# Altium schematic sheet 03 - ETHERNET.SchDoc
size A4
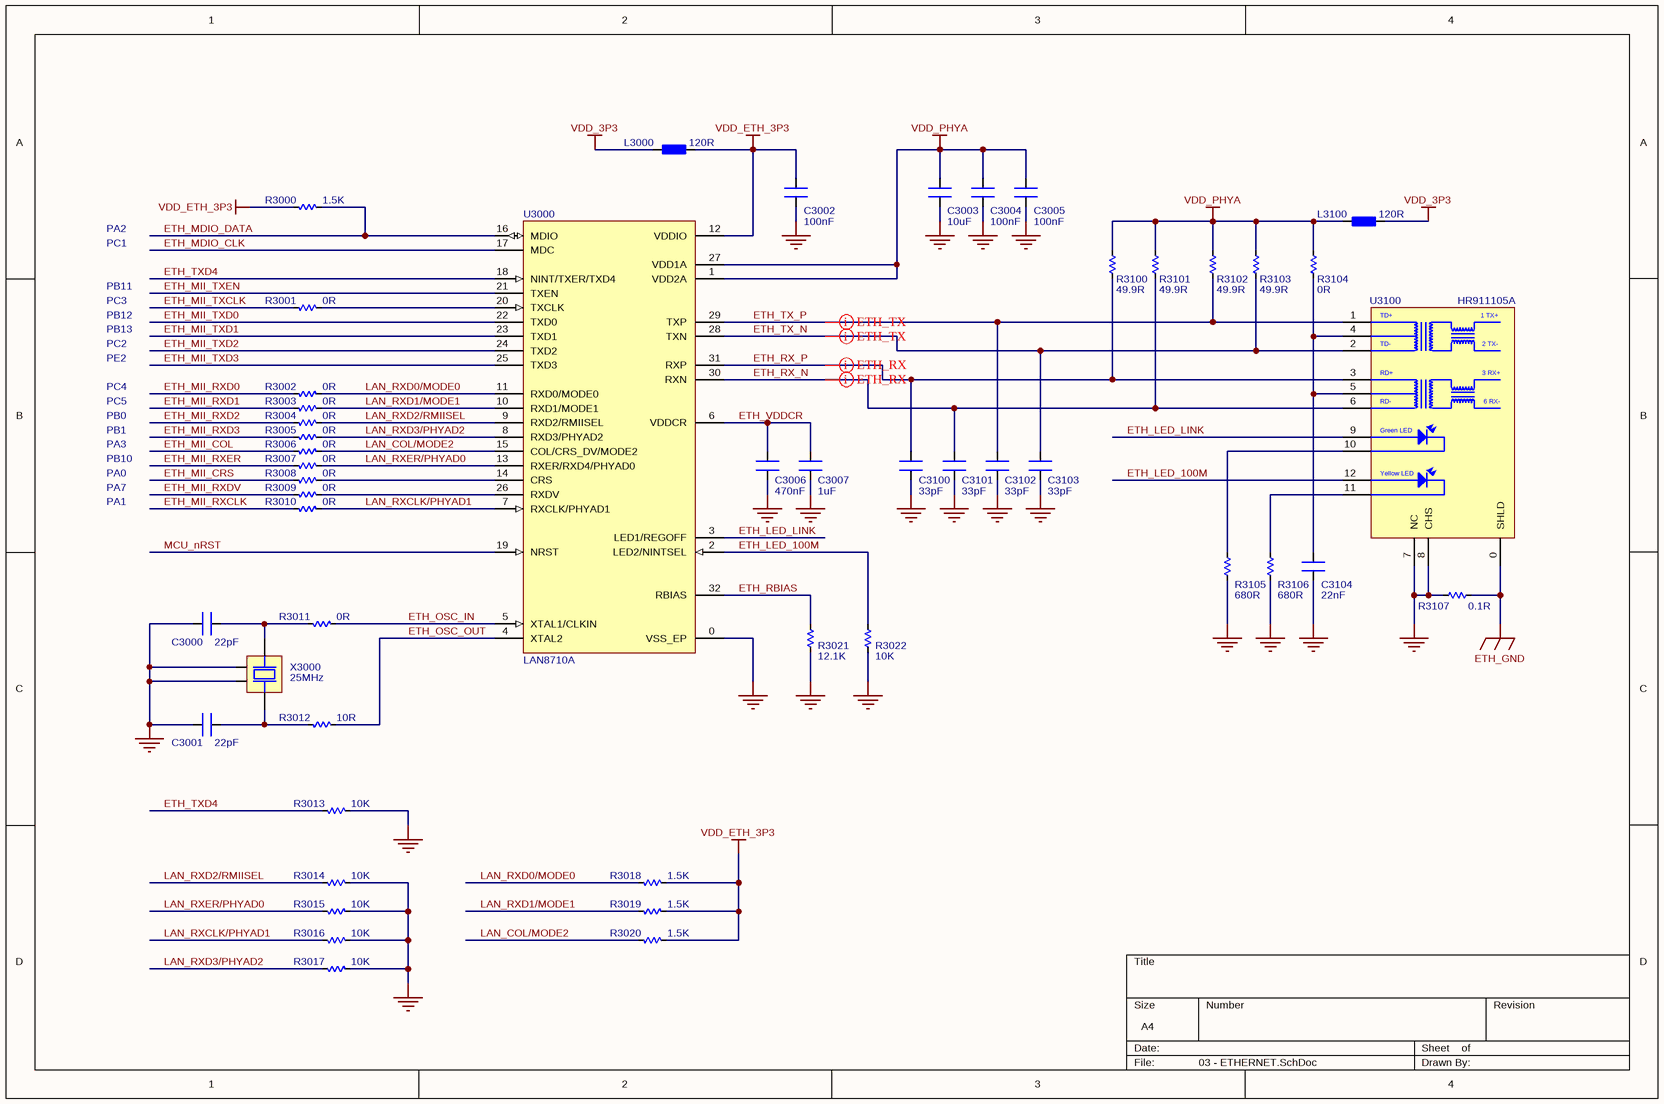
[diagram p0: 03 - ETHERNET.SchDoc]

## Parts
C3000  value 22pF  [CN-SMD-0402]  (hidden comment: Capacitor)
C3001  value 22pF  [CN-SMD-0402]  (hidden comment: Capacitor)
C3002  value 100nF  [CN-SMD-0402]  (hidden comment: Capacitor)
C3003  value 10uF  [CN-SMD-0603]  (hidden comment: Capacitor)
C3004  value 100nF  [CN-SMD-0402]  (hidden comment: Capacitor)
C3005  value 100nF  [CN-SMD-0402]  (hidden comment: Capacitor)
C3006  value 470nF  [CN-SMD-0402]  (hidden comment: Capacitor)
C3007  value 1uF  [CN-SMD-0603]  (hidden comment: Capacitor)
C3100  value 33pF  [CN-SMD-0402]  (hidden comment: Capacitor)
C3101  value 33pF  [CN-SMD-0402]  (hidden comment: Capacitor)
C3102  value 33pF  [CN-SMD-0402]  (hidden comment: Capacitor)
C3103  value 33pF  [CN-SMD-0402]  (hidden comment: Capacitor)
C3104  value 22nF  [CN-SMD-0402]  (hidden comment: Capacitor)
L3000  value 120R  [L-SMD-0603]  (hidden comment: Ferrite bead)
L3100  value 120R  [L-SMD-0603]  (hidden comment: Ferrite bead)
R3000  value 1.5K  [RES-SMD-0402]  (hidden comment: Resistor)
R3001  value 0R  [RES-SMD-0402]  (hidden comment: Resistor)
R3002  value 0R  [RES-SMD-0402]  (hidden comment: Resistor)
R3003  value 0R  [RES-SMD-0402]  (hidden comment: Resistor)
R3004  value 0R  [RES-SMD-0402]  (hidden comment: Resistor)
R3005  value 0R  [RES-SMD-0402]  (hidden comment: Resistor)
R3006  value 0R  [RES-SMD-0402]  (hidden comment: Resistor)
R3007  value 0R  [RES-SMD-0402]  (hidden comment: Resistor)
R3008  value 0R  [RES-SMD-0402]  (hidden comment: Resistor)
R3009  value 0R  [RES-SMD-0402]  (hidden comment: Resistor)
R3010  value 0R  [RES-SMD-0402]  (hidden comment: Resistor)
R3011  value 0R  [RES-SMD-0402]  (hidden comment: Resistor)
R3012  value 10R  [RES-SMD-0402]  (hidden comment: Resistor)
R3013  value 10K  [RES-SMD-0402]  (hidden comment: Resistor)
R3014  value 10K  [RES-SMD-0402]  (hidden comment: Resistor)
R3015  value 10K  [RES-SMD-0402]  (hidden comment: Resistor)
R3016  value 10K  [RES-SMD-0402]  (hidden comment: Resistor)
R3017  value 10K  [RES-SMD-0402]  (hidden comment: Resistor)
R3018  value 1.5K  [RES-SMD-0402]  (hidden comment: Resistor)
R3019  value 1.5K  [RES-SMD-0402]  (hidden comment: Resistor)
R3020  value 1.5K  [RES-SMD-0402]  (hidden comment: Resistor)
R3021  value 12.1K  [RES-SMD-0402]  (hidden comment: Resistor)
R3022  value 10K  [RES-SMD-0402]  (hidden comment: Resistor)
R3100  value 49.9R  [RES-SMD-0402]  (hidden comment: Resistor)
R3101  value 49.9R  [RES-SMD-0402]  (hidden comment: Resistor)
R3102  value 49.9R  [RES-SMD-0402]  (hidden comment: Resistor)
R3103  value 49.9R  [RES-SMD-0402]  (hidden comment: Resistor)
R3104  value 0R  [RES-SMD-0402]  (hidden comment: Resistor)
R3105  value 680R  [RES-SMD-0402]  (hidden comment: Resistor)
R3106  value 680R  [RES-SMD-0402]  (hidden comment: Resistor)
R3107  value 0.1R  [RES-SMD-1206]  (hidden comment: Resistor)
U3000  LAN8710A  [QFN50P500X500X100-33N-D]
U3100  HR911105A  [RJ-45_HR911105A]
X3000  value 25MHz  [XT-SMD-3225-4P]  (hidden comment: Crystal)

## Nets
ETH_GND: R3107.2 U3100.0(SHLD)
GND: C3000.2 C3001.2 C3002.1 C3003.1 C3004.1 C3005.1 C3006.1 C3007.1 C3100.1 C3101.1 C3102.1 C3103.1 C3104.1 R3013.1 R3014.1 R3015.1 R3016.1 R3017.1 R3021.1 R3022.2 R3105.2 R3106.2 R3107.1 U3000.0(VSS_EP) U3100.7(NC) U3100.8(CHS) X3000.2 X3000.4
VDD_3P3: L3000.2 L3100.1
VDD_ETH_3P3: C3002.2 L3000.1 R3000.2 R3018.1 R3019.1 R3020.1 U3000.12(VDDIO)
VDD_PHYA: C3003.2 C3004.2 C3005.2 L3100.2 R3100.1 R3101.1 R3102.1 R3103.1 R3104.1 U3000.1(VDD2A) U3000.27(VDD1A)
ETH_LED_100M: R3022.1 U3000.2(LED2/NINTSEL) U3100.12(Yellow+)
ETH_LED_LINK: U3000.3(LED1/REGOFF) U3100.9(Green+)
ETH_MDIO_CLK: U3000.17(MDC)
ETH_MDIO_DATA: R3000.1 U3000.16(MDIO)
ETH_MII_COL: R3006.2
ETH_MII_CRS: R3008.2
ETH_MII_RXCLK: R3010.2
ETH_MII_RXD0: R3002.2
ETH_MII_RXD1: R3003.2
ETH_MII_RXD2: R3004.2
ETH_MII_RXD3: R3005.2
ETH_MII_RXDV: R3009.2
ETH_MII_RXER: R3007.2
ETH_MII_TXCLK: R3001.2
ETH_MII_TXD0: U3000.22(TXD0)
ETH_MII_TXD1: U3000.23(TXD1)
ETH_MII_TXD2: U3000.24(TXD2)
ETH_MII_TXD3: U3000.25(TXD3)
ETH_MII_TXEN: U3000.21(TXEN)
ETH_OSC_IN: R3011.1 U3000.5(XTAL1/CLKIN)
ETH_OSC_OUT: R3012.1 U3000.4(XTAL2)
ETH_RBIAS: R3021.2 U3000.32(RBIAS)
ETH_RX_N: C3101.2 R3101.2 U3000.30(RXN) U3100.6(RD-)
ETH_RX_P: C3100.2 R3100.2 U3000.31(RXP) U3100.3(RD+)
ETH_TX_N: C3103.2 R3103.2 U3000.28(TXN) U3100.2(TD-)
ETH_TX_P: C3102.2 R3102.2 U3000.29(TXP) U3100.1(TD+)
ETH_TXD4: R3013.2 U3000.18(NINT/TXER/TXD4)
ETH_VDDCR: C3006.2 C3007.2 U3000.6(VDDCR)
LAN_COL/MODE2: R3006.1 R3020.2 U3000.15(COL/CRS_DV/MODE2)
LAN_RXCLK/PHYAD1: R3010.1 R3016.2 U3000.7(RXCLK/PHYAD1)
LAN_RXD0/MODE0: R3002.1 R3018.2 U3000.11(RXD0/MODE0)
LAN_RXD1/MODE1: R3003.1 R3019.2 U3000.10(RXD1/MODE1)
LAN_RXD2/RMIISEL: R3004.1 R3014.2 U3000.9(RXD2/RMIISEL)
LAN_RXD3/PHYAD2: R3005.1 R3017.2 U3000.8(RXD3/PHYAD2)
LAN_RXER/PHYAD0: R3007.1 R3015.2 U3000.13(RXER/RXD4/PHYAD0)
MCU_nRST: U3000.19(NRST)
NetC3000_1: C3000.1 R3011.2 X3000.3
NetC3001_1: C3001.1 R3012.2 X3000.1
NetC3104_2: C3104.2 R3104.2 U3100.4(2,5V) U3100.5(2,5V)
NetR3001_1: R3001.1 U3000.20(TXCLK)
NetR3008_1: R3008.1 U3000.14(CRS)
NetR3009_1: R3009.1 U3000.26(RXDV)
NetR3105_1: R3105.1 U3100.10(Green-)
NetR3106_1: R3106.1 U3100.11(Yellow-)

## Layout directives
differential pair; differential pair class ETH_TX: ETH_TX_N, ETH_TX_P
differential pair; differential pair class ETH_RX: ETH_RX_N, ETH_RX_P

## Notes on the sheet
- PA2
- PC1
- PB11
- PB12
- PB13
- PC3
- PC2
- PC4
- PC5
- PE2
- PA0
- PA3
- PB0
- PB1
- PB10
- PA1
- PA7
- (in symbol HR911105A) 1 TX+; 2 TX-; 3 RX+; 6 RX-; Green LED; Yellow LED

## Library data of the parts
C3000 C3001 = Cap: Ceramic Capacitor SMD 0402 22pF ±20% 50V
C3002 C3004 C3005 = Cap: Ceramic Capacitor SMD 0402 100nF ±20% 16V
C3003 = Cap: Ceramic Capacitor SMD 0603 10uF ±20% 10V
C3006 = Cap: Ceramic Capacitor SMD 0402 470nF ±20% 10V
C3007 = Cap: Ceramic Capacitor SMD 0603 1uF ±20% 50V
C3100-C3103 = Cap: Ceramic Capacitor SMD 0402 33pF ±20% 50V
C3104 = Cap: Ceramic Capacitor SMD 0402 22nF ±20% 50V
L3000 L3100 = Ferrite bead: Ferrite bead SMD 0603 120 Ohm @100MHz
R3000 R3018-R3020 = Res: Resistor SMD 0402 1.5K 1% 0.063W
R3001-R3011 R3104 = Res: Resistor SMD 0402 0R 1% 0.063W
R3012 = Res: Resistor SMD 0402 10R 1% 0.063W
R3013-R3017 R3022 = Res: Resistor SMD 0402 10K 1% 0.063W
R3021 = Res: Resistor SMD 0402 12.1K 1% 0.063W
R3100-R3103 = Res: Resistor SMD 0402 49.9R 1% 0.063W
R3105 R3106 = Res: Resistor SMD 0402 680R 1% 0.063W
R3107 = Res: Resistor SMD 1206 0.1R 1% 0.25W
U3000 = LAN8710A: Microchip MII/RMII 10/100 Ethernet Transceiver / with HP Auto-MDIX and flexPWR® Technology; Manufacturer_Part_Number: LAN8710AI-EZK; Datasheet Link: http://docs-emea.rs-online.com/webdocs/11b5/0900766b811b5c4b.pdf; Height: 1mm; Manufacturer_Name: Microchip; Mouser Part Number: 886-LAN8710AI-EZK; Mouser Price/Stock: https://www.mouser.com/Search/Refine.aspx?Keyword=886-LAN8710AI-EZK; RS Part Number: 7748024P; RS Price/Stock: http://uk.rs-online.com/web/p/products/7748024P
U3100 = HR911105A: HanRun Single port RJ45 Connector with Integrated Magnetics and LED for 10/100-BaseTX NIC Applications; Value: HR911105A
X3000 = XT4: Crystal Oscillator SMD-3225 25MHz 4-pin